# EAGLE design low_power_rfnode (EAGLE 6.4)
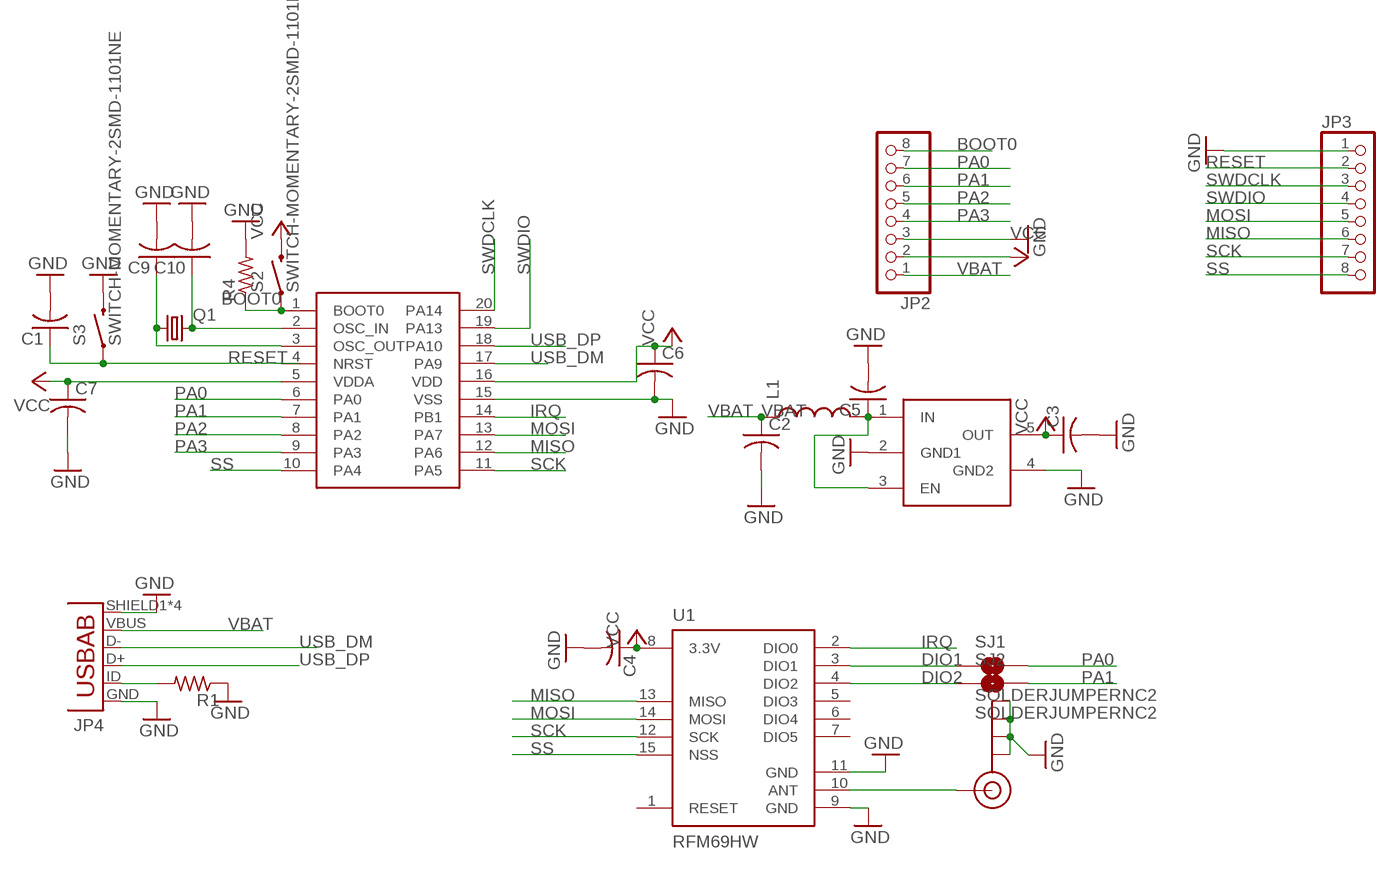
[diagram p0: schematic, sheet 1]

## Parts
C1  C-USC0805K  [C0805K]
C2  C-USC0805K  [C0805K]
C3  C-USC0805K  [C0805K]
C4  C-USC0805K  [C0805K]
C5  C-USC0805K  [C0805K]
C6  C-USC0805K  [C0805K]
C7  C-USC0805K  [C0805K]
C9  C-USC0805K  [C0805K]
C10  C-USC0805K  [C0805K]
J1  SMA_EDGE  [SMA-EDGE]
JP2  PINHD-1X8BIG  [1X08-BIG]
JP3  PINHD-1X8BIG  [1X08-BIG]
JP4  USB-AB  [USB-AB-MICRO-SMD]
L1  INDUCTOR0805  [0805]
Q1  CRYSTALHC49S  [HC49/S]
R1  R-US_R0805  [R0805]
R4  R-US_R0805  [R0805]
REG  TPS783  [SOT23-5]
S2  SWITCH-MOMENTARY-2SMD-1101NE  [TACTILE-SWITCH-1101NE]
S3  SWITCH-MOMENTARY-2SMD-1101NE  [TACTILE-SWITCH-1101NE]
SJ1  SOLDERJUMPERNC2  [SJ_2S-NOTRACE]
SJ2  SOLDERJUMPERNC2  [SJ_2S-NOTRACE]
U1  RFM69HW  [RFM69W-XXXS2]
U$1  STM32F0  [TSSOP20]

## Nets
BOOT0: JP2.8 R4.1 S2.1 U$1.1(BOOT0)
DIO1: SJ1.1 U1.3(DIO1)
DIO2: SJ2.1 U1.4(DIO2)
GND: C1.2 C2.2 C3.2 C4.2 C5.2 C6.2 C7.2 C9.2 C10.2 J1.GND@0(GND) J1.GND@1(GND) J1.GND@2(GND) J1.GND@3(GND) JP2.3 JP3.1 JP4.GND JP4.SHIELD1(SHIELD) JP4.SHIELD2(SHIELD) JP4.SHIELD3(SHIELD) JP4.SHIELD4(SHIELD) R1.1 R4.2 REG.2(GND1) REG.4(GND2) S3.2 U1.9(GND) U1.11(GND) U$1.15(VSS)
IRQ: U1.2(DIO0) U$1.14(PB1)
MISO: JP3.6 U1.13(MISO) U$1.12(PA6)
MOSI: JP3.5 U1.14(MOSI) U$1.13(PA7)
N$1: C10.1 Q1.2 U$1.2(OSC_IN)
N$2: JP4.ID(USBID) R1.2
N$3: C9.1 Q1.1 U$1.3(OSC_OUT)
N$4: C5.1 L1.2 REG.1(IN) REG.3(EN)
N$6: J1.SIG(SIGNAL) U1.10(ANT)
PA0: JP2.7 SJ1.2 U$1.6(PA0)
PA1: JP2.6 SJ2.2 U$1.7(PA1)
PA2: JP2.5 U$1.8(PA2)
PA3: JP2.4 U$1.9(PA3)
RESET: C1.1 JP3.2 S3.1 U$1.4(NRST)
SCK: JP3.7 U1.12(SCK) U$1.11(PA5)
SS: JP3.8 U1.15(NSS) U$1.10(PA4)
SWDCLK: JP3.3 U$1.20(PA14)
SWDIO: JP3.4 U$1.19(PA13)
USB_DM: JP4.D- U$1.17(PA9)
USB_DP: JP4.D+ U$1.18(PA10)
VBAT: C2.1 JP2.1 JP4.VBUS L1.1
VCC: C3.1 C4.1 C6.1 C7.1 JP2.2 REG.5(OUT) S2.2 U1.8(3.3V) U$1.5(VDDA) U$1.16(VDD)
Unconnected: U1.1(RESET) U1.5(DIO3) U1.6(DIO4) U1.7(DIO5)

## Library data of the parts
C1-C7 C9 C10 = adafruit:C-US: CAPACITOR, American symbol
J1 = mike-temp:SMA: SMA Antenna Connector End launch SMA connector. The paste layer has been removed so that the connector can be hand soldered onto the board after reflow.
JP2 JP3 = adafruit:PINHD-1X8: PIN HEADER
JP4 = SparkFun-Connectors:USB-AB: This is a USB AB connector that is compatible with USB OTG. i.e. this connector can serve as a host or device
L1 = SparkFun-Passives:INDUCTOR: Inductors Basic Inductor/Choke - 0603 and 1206. Footprints are not proven and vary greatly between part numbers. INDUCTOR POWER 3.3UH 4.0A SMD 0.197" L x 0.197" W x 0.177" H (5.00mm x 5.00mm x 4.50mm)
Q1 = adafruit:CRYSTAL: CRYSTAL; OC_FARNELL: 1667008; OC_NEWARK: unknown
R1 R4 = adafruit:R-US_: RESISTOR, American symbol
REG = jpiat:TPS783
S2 S3 = SparkFun-Electromechanical:SWITCH-MOMENTARY-2: Various NO switches- pushbuttons, reed, etc; PROD_ID: SWCH-00815
SJ1 SJ2 = mike-temp:SOLDERJUMPER: Solder Jumper Standard SMD solder jumper. Used to automate production. Two varients : Normally Open and Normally Closed are the same, but have different paste layers. NC will have a large amount of paste and should jumper during reflow.
U1 = mike-temp:RFM69H
U$1 = jpiat:STM32F0

## Board
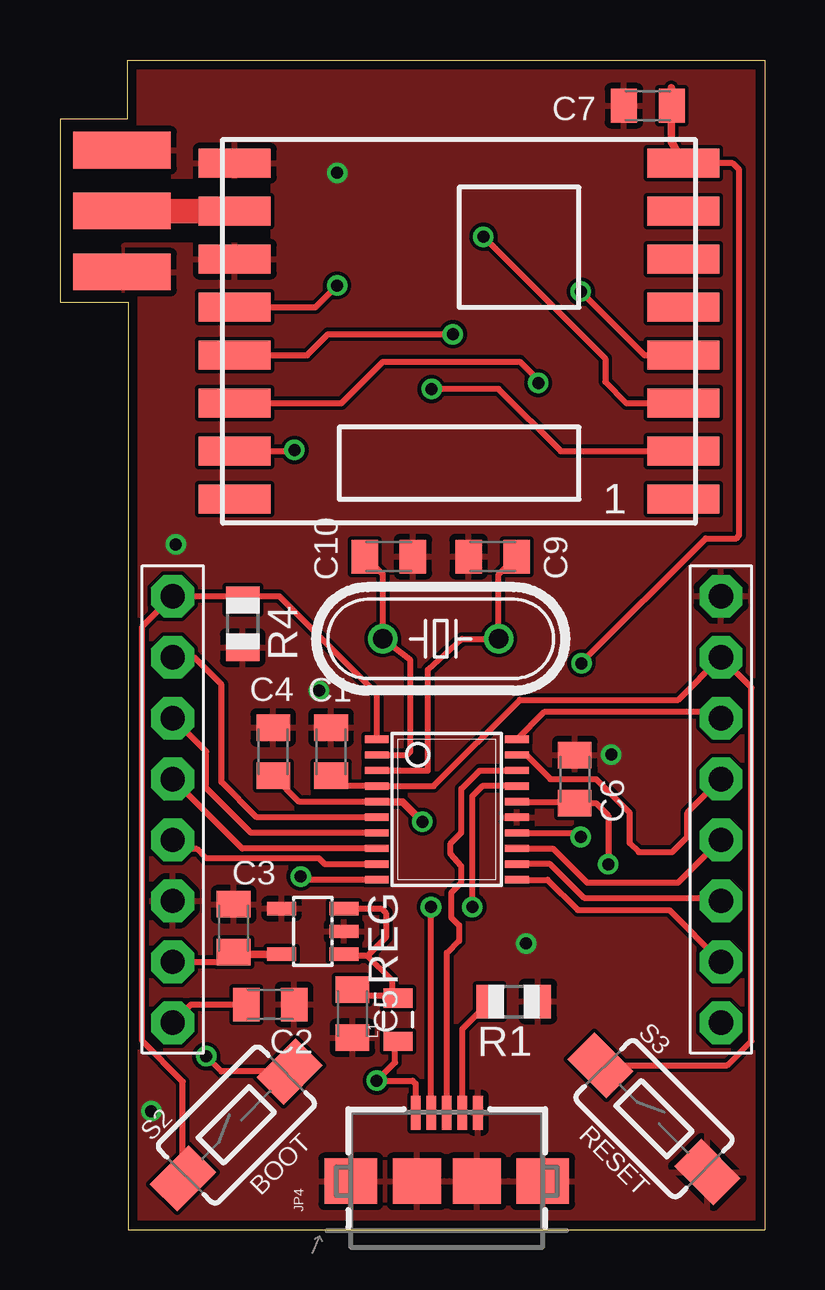
[diagram p1: board, top side]
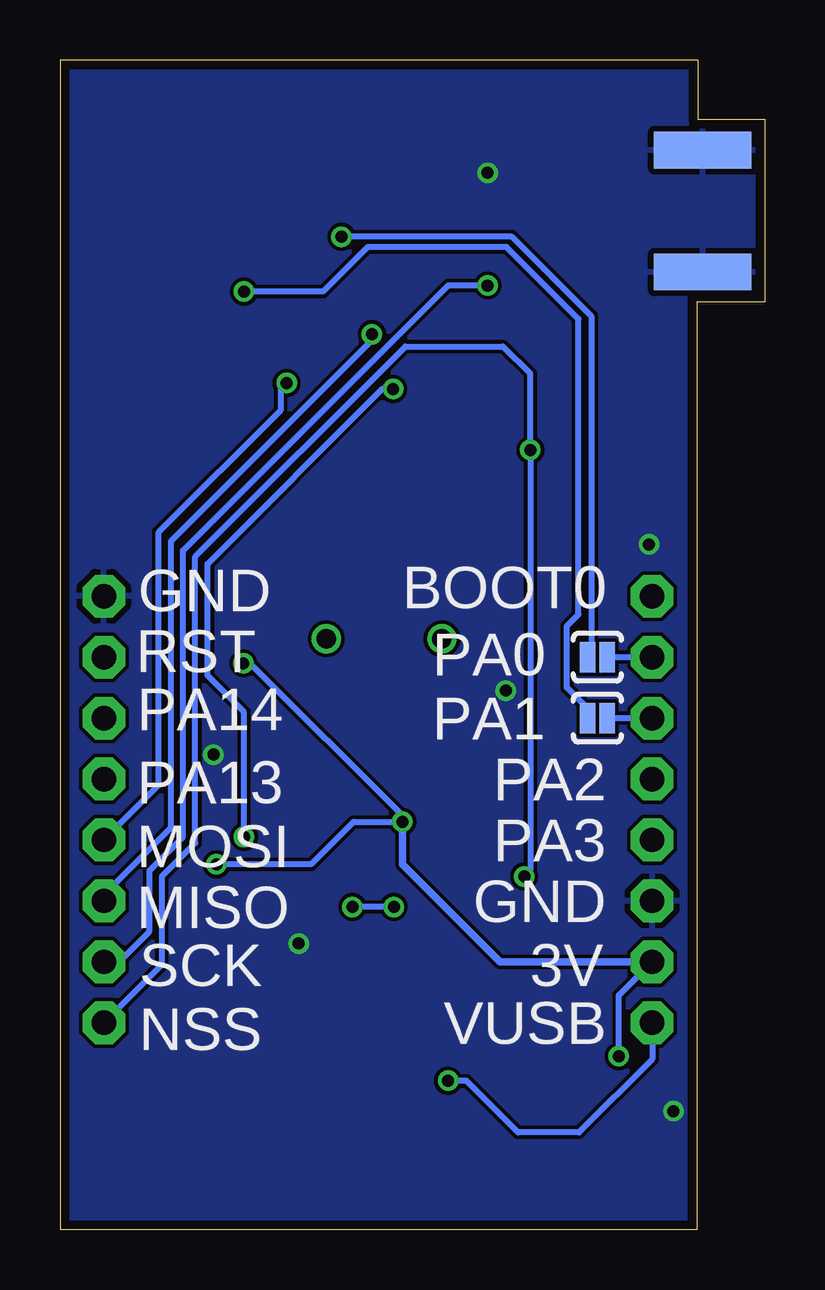
[diagram p2: board, bottom side, seen from below]

Size 29.39 x 48.77 mm. Coordinates in mm from the lower left corner, seen from the top.
Outline: 2.84,0 29.39,0 29.39,48.77 2.79,48.77 2.79,46.3 0,46.3 0,38.68 2.84,38.68 2.84,0
Copper layers (1*16): Top 0.0356mm / dielectric 1.5011mm / Bottom 0.0356mm
Design rules "LaenPCBOrder": minimum track width 6mil, minimum drill 13mil, track to track 6mil, track to pad 6mil, pad to pad 6mil, via to via 6mil, smd to smd 6mil, copper to edge 15mil, drill to drill 6mil, minimum pad ring 7mil, minimum via ring 7mil, stop-mask expansion 3mil, vias tented up to drill 20mil, thermal gap 10mil

### Footprints (pad centres in the part's own frame; a part is rotated, then mirrored left to right if it is on the bottom)
C0805K = smd 1.1 x 1.4: 1 -1,0; 2 1,0
SMA-EDGE = smd 1.524 x 4.064: GND@0 0,0; GND@1 5.08,0; SIG 2.54,0 | smd 1.524 x 4.064 bottom: GND@2 0,0; GND@3 5.08,0
1X08-BIG = drill 1.016 pad 1.778 octagon: 1 -8.89,0; 2 -6.35,0; 3 -3.81,0; 4 -1.27,0; 5 1.27,0; 6 3.81,0; 7 6.35,0; 8 8.89,0
USB-AB-MICRO-SMD = smd 1.4 x 0.4: D+ 2.85,0; D- 2.85,0.65; GND 2.85,-1.3; ID 2.85,-0.65; VBUS 2.85,1.3 | smd 1.9 x 2.2: SHIELD1 0,4; SHIELD4 0,-4 | smd 1.9 x 2: SHIELD2 0,1.25; SHIELD3 0,-1.25
0805 = smd 0.8 x 1.2: 1 -0.9,0; 2 0.9,0
HC49/S = drill 0.813: 1 -2.413,0; 2 2.413,0
R0805 = smd 1.1 x 1.4: 1 -1,0; 2 1,0
SOT23-5 = smd 0.55 x 1.2: 1 -0.95,-1.3; 2 0,-1.3; 3 0.95,-1.3; 4 0.95,1.3; 5 -0.95,1.3
TACTILE-SWITCH-1101NE = smd 2.3 x 1.6: 1 -3.15,0; 2 3.15,0
SJ_2S-NOTRACE = smd 0.635 x 1.27: 1 -0.401,0; 2 0.413,0
RFM69W-XXXS2 = smd 3 x 1.2: 1 -9.35,7; 2 -9.35,5; 3 -9.35,3; 4 -9.35,1; 5 -9.35,-1; 6 -9.35,-3; 7 -9.35,-5; 8 -9.35,-7; 9 9.35,-7; 10 9.35,-5; 11 9.35,-3; 12 9.35,-1; 13 9.35,1; 14 9.35,3; 15 9.35,5; 16 9.35,7
TSSOP20 = smd 0.305 x 0.991: 1 -2.925,-2.918; 2 -2.275,-2.918; 3 -1.625,-2.918; 4 -0.975,-2.918; 5 -0.325,-2.918; 6 0.325,-2.918; 7 0.975,-2.918; 8 1.625,-2.918; 9 2.275,-2.918; 10 2.925,-2.918; 11 2.925,2.918; 12 2.275,2.918; 13 1.625,2.918; 14 0.975,2.918; 15 0.325,2.918; 16 -0.325,2.918; 17 -0.975,2.918; 18 -1.625,2.918; 19 -2.275,2.918; 20 -2.925,2.918

### Placement (x,y rotation side)
C1  11.3,19.94 90 top
C2  8.76,9.4 0 top
C3  7.24,12.57 90 top
C4  8.89,19.94 90 top
C5  12.19,9.02 270 top
C6  21.46,18.8 90 top
C7  24.51,46.86 180 top
C9  18.03,28.07 180 top
C10  13.72,28.07 0 top
J1  2.59,39.93 90 top
JP2  4.7,17.53 90 top
JP3  27.56,17.53 270 top
JP4  16.13,2.03 90 top
L1  14.1,8.76 90 top
Q1  15.88,24.64 180 top
R1  18.92,9.53 180 top
R4  7.62,25.27 270 top
REG  10.54,12.45 90 top
S2  7.35,4.38 45 top
S3  24.76,4.64 315 top
SJ1  6.98,23.88 0 bottom
SJ2  6.98,21.34 0 bottom
U1  16.64,37.47 180 top
U$1  16.13,17.53 270 top

### Tracks (layer width: path | path; a pad name or v marks a point on that pad's centre or on a via)
BOOT0
  Top 0.254: 7.49,26.42 JP2.8 3.43,25.15 3.43,7.87 5.12,6.18 S2.1 | 7.49,26.42 9.14,26.42 13.21,22.35 U$1.1 | R4.1 7.49,26.43 7.49,26.42
DIO1  (via drill 0.5)
  Top 0.254: v17.65,41.4 22.73,36.32 22.73,35.35 23.62,34.47 U1.3
  Bottom 0.254: v17.65,41.4 10.54,41.4 7.24,38.1 7.24,24.02 SJ1.1
DIO2  (via drill 0.5)
  Top 0.254: v21.72,39.12 24.37,36.47 U1.4
  Bottom 0.254: SJ2.1 7.39,21.74 8.26,22.61 8.26,25.17 7.77,25.65 7.77,37.97 10.77,40.97 16.56,40.97 18.41,39.12 v21.72,39.12
GND  (via drill 0.5)
  other vias: 19.43,11.94 22.99,19.81 3.81,4.95 10.79,22.48 11.56,44.07 4.83,28.57
  pour Top: 2.67,-6.48 30.35,-6.48 30.48,6.86 35.05,6.99 35.05,49.53 2.79,49.4 2.92,43.94 8.89,43.94 8.89,41.02 2.67,41.02
  pour Bottom: 2.79,49.4 34.92,49.66 34.67,-1.52 2.67,-1.78 2.92,39.62 -1.14,39.62 -1.14,47.24 2.79,47.24
IRQ  (via drill 0.5)
  Top 0.254: v15.49,35.05 18.29,35.05 20.88,32.47 U1.2 | U$1.14 21.55,16.55 v21.72,16.38
  Bottom 0.254: v21.72,16.38 21.72,21.59 23.24,23.11 23.24,27.77 15.96,35.05 v15.49,35.05
MISO  (via drill 0.5)
  Top 0.254: 16.37,37.35 v16.38,37.34 11.18,37.34 10.3,36.47 U1.13 | U$1.12 20.44,15.25 21.84,13.84 27.43,13.84 JP3.6
  Bottom 0.254: v16.38,37.34 16.38,37.08 24.77,28.7 24.77,16.76 27.56,13.97 JP3.6
MOSI  (via drill 0.5)
  Top 0.254: U$1.13 20.55,15.9 21.97,14.48 25.78,14.48 JP3.5 | 19.89,35.35 v19.94,35.31 19.94,35.43 19.18,36.2 13.46,36.2 11.73,34.47 U1.14
  Bottom 0.254: v19.94,35.31 20.19,35.31 20.19,34.16 25.27,29.08 25.27,18.54 JP3.5 26.92,16.89
N$1
  Top 0.254: U$1.2 14.47,19.8 14.61,19.94 14.61,23.75 Q1.2 13.46,27.32 C10.1
N$2
  Top 0.254: JP4.ID 16.78,8.38 R1.2
N$3
  Top 0.254: U$1.3 15.34,19.15 15.34,23.34 16.76,24.64 Q1.1 18.29,27.32 C9.1
N$4
  Top 0.254: 12.83,11.43 13.84,10.41 13.84,9.92 L1.2 13.87,9.76 12.45,9.76 C5.1 | 12.83,11.43 11.91,11.43 REG.1 | REG.3 13.4,13.4 13.59,13.21 13.59,12.19 12.83,11.43
N$6
  Top 0.406: 6.77,42.47 U1.10
  Top 1.016: 6.77,42.47 J1.SIG
PA0
  Top 0.254: JP2.7 5.59,23.88 6.73,22.73 6.73,18.67 8.2,17.2 U$1.6
  Bottom 0.254: SJ1.2 JP2.7
PA1
  Top 0.254: JP2.6 6.1,19.94 6.1,18.41 7.96,16.55 U$1.7
  Bottom 0.254: SJ2.2 JP2.6
PA2
  Top 0.254: JP2.5 7.59,15.9 U$1.8
PA3
  Top 0.254: U$1.9 13.2,15.24 11.05,15.24 10.79,15.49 6.1,15.49 5.71,15.88 5.21,15.88 | JP2.4 4.95,16 5.21,16 5.21,15.88 | 5.21,15.88 5.08,15.88
RESET
  Top 0.254: C1.1 11.74,18.5 U$1.4 15.58,18.5 19.18,22.1 25.78,22.1 JP3.2 28.83,22.61 28.83,7.87 27.82,6.87 S3.1
SCK  (via drill 0.5)
  Top 0.254: 11.54,39.35 v11.56,39.37 10.65,38.47 U1.12 | U$1.11 20.32,14.6 21.59,13.34 25.4,13.34 JP3.7
  Bottom 0.254: v11.56,39.37 13.21,39.37 24.26,28.32 24.26,16.38 25.65,14.99 25.65,12.45 26.92,11.18 JP3.7
SS  (via drill 0.5)
  Top 0.254: U$1.10 10.16,14.6 v10.03,14.73 | U1.15 9.73,32.47 v9.78,32.51
  Bottom 0.254: JP3.8 25.15,11.05 25.15,14.73 23.75,16.13 23.75,28.07 14.99,36.83 10.92,36.83 9.78,35.69 v9.78,32.51 9.78,14.99 v10.03,14.73
SWDCLK
  Top 0.254: U$1.20 20.19,21.59 27.3,21.59 JP3.3
SWDIO
  Top 0.254: U$1.19 19.06,19.81 19.43,19.81 20.45,18.8 22.35,18.8 23.75,17.4 23.75,16.13 24.13,15.75 25.53,15.75 26.16,16.38 26.16,17.4 JP3.4
USB_DM  (via drill 0.5)
  Top 0.254: U$1.17 17.61,18.5 17.2,18.09 v17.2,13.46 | v15.48,13.45 v15.47,13.46 15.47,5.27 JP4.D-
  Bottom 0.254: v15.47,13.46 v17.2,13.46
USB_DP
  Top 0.254: U$1.18 17.5,19.15 16.74,18.39 16.74,16.56 16.28,16.1 16.28,15.67 16.74,15.16 16.74,14.48 16.31,14.05 16.31,13.03 16.64,12.7 16.64,12.04 16.15,11.56 16.13,11.56 JP4.D+
VBAT  (via drill 0.5)
  Top 0.254: 13.97,8.13 L1.1 13.97,7.74 13.97,6.99 v13.21,6.22 14.7,6.22 14.83,6.1 JP4.VBUS | JP2.1 5.46,9.4 C2.1
  Bottom 0.254: JP2.1 4.7,7.11 7.75,4.06 10.29,4.06 12.45,6.22 v13.21,6.22
VCC  (via drill 0.5)
  Top 0.254: 21.34,17.67 21.34,17.53 21.59,17.78 21.7,17.67 | U$1.16 21.41,17.85 C6.1 22.34,17.8 22.86,17.27 v22.86,15.24 | U$1.5 9.98,17.85 C4.1 | 25.49,45.36 U1.8 28.05,44.47 28.32,44.2 28.32,28.96 28.19,28.83 26.92,28.83 21.74,23.65 | S2.2 6.73,6.6 v6.1,7.24 | JP2.2 6.84,11.18 C3.1 | 7.44,11.45 6.86,11.45 6.86,11.18
  Top 0.305: 7.04,11.5 C3.1 | U$1.5 14.28,17.85 v15.11,17.02 | v21.74,23.62 21.74,23.65 | 25.51,45.39 U1.8 25.49,45.34 25.49,47.61 C7.1 | REG.5 7.49,11.5 7.44,11.45 | 6.71,11.18 6.86,11.18 7.11,11.18 7.24,11.3 C3.1 | 21.59,17.78 21.57,17.8 C6.1 | 7.24,11.18 C3.1
  Bottom 0.254: v15.11,17.02 17.14,17.02 18.92,15.24 v22.86,15.24 | v21.74,23.62 21.46,23.62 15.11,17.27 | v6.1,7.24 6.1,9.78 JP2.2
  Bottom 0.305: JP2.2 11.05,11.18 15.11,15.24 v15.11,17.02 15.11,17.27

### Text on the board
tPlace: RESET | BOOT
bPlace: BOOT0 | GND | PA0 | RST | PA14 | PA1 | PA2 | PA13 | PA3 | MOSI | GND | MISO | 3V | SCK | VUSB | NSS